# Altium schematic sheet 02-I_O.SchDoc
size 246 x 182 mm
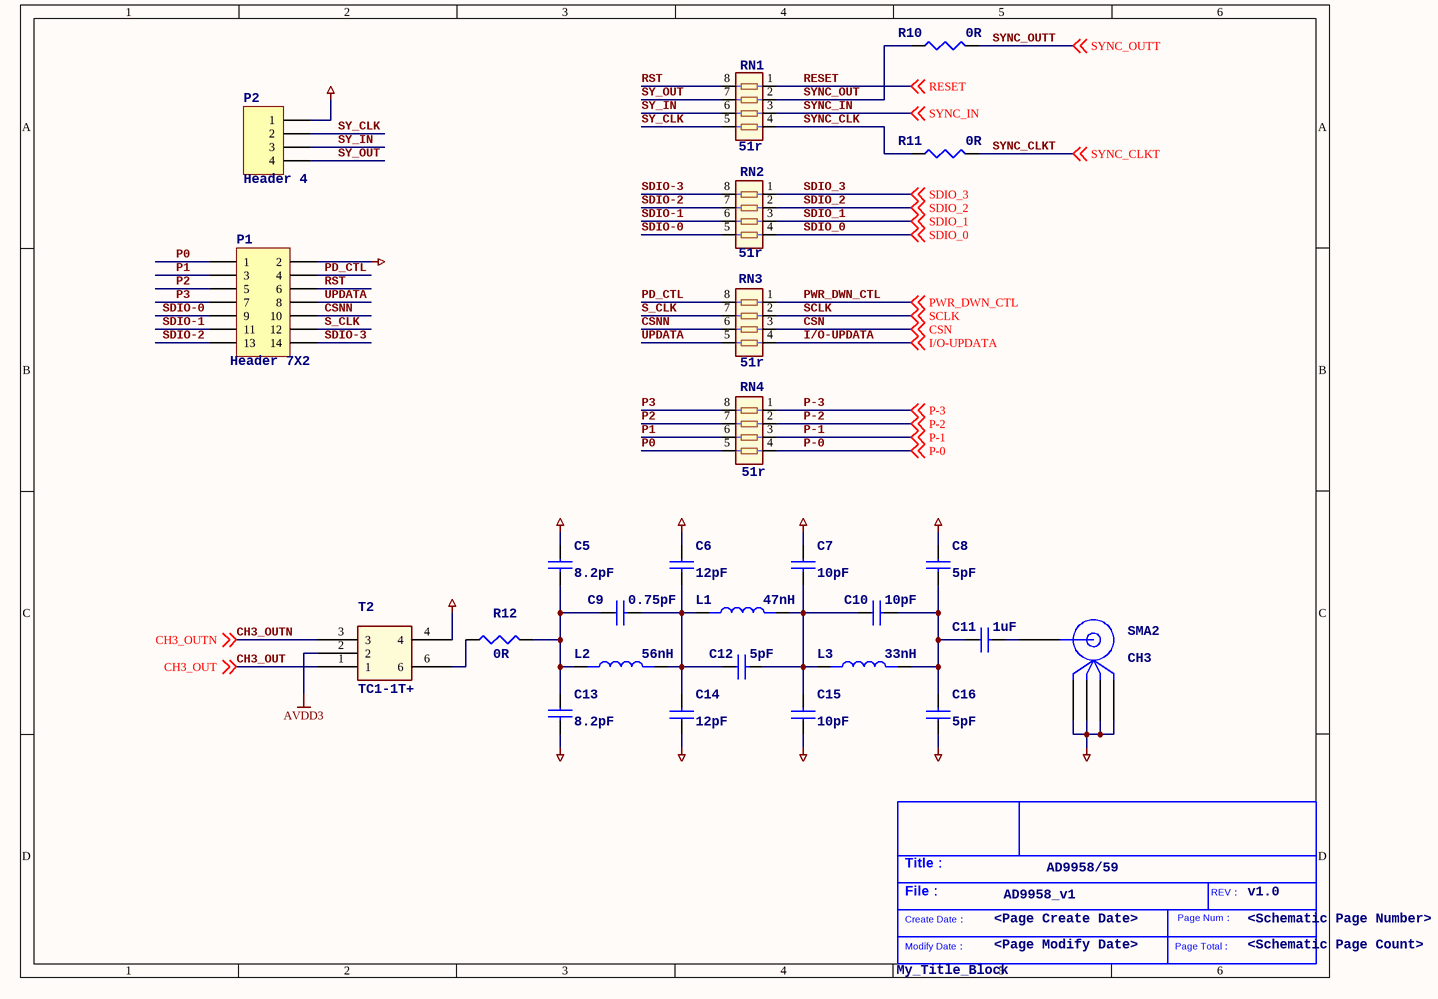
[diagram p0: 02-I_O.SchDoc]

## Parts
*  My_Title_Block  Schematic Page Count: <Schematic Page Count>  Schematic Page Number: <Schematic Page Number>  Page Modify Date: <Page Modify Date>  Page Create Date: <Page Create Date>  Revcode: v1.0  File: AD9958_v1  Title: AD9958/59  (graphical)
C5  8.2pF  [0603C]
C6  12pF  [0603C]
C7  10pF  [0603C]
C8  5pF  [0603C]
C9  0.75pF  [0603C]
C10  10pF  [0603C]
C11  1uF  [0603C]
C12  5pF  [0603C]
C13  8.2pF  [0603C]
C14  12pF  [0603C]
C15  10pF  [0603C]
C16  5pF  [0603C]
L1  47nH  [0603L]
L2  56nH  [0603L]
L3  33nH  [0603L]
P1  Header 7X2  [CON20VP2R54-2X7TM-1]
P2  Header 4  [HDR1X4]
R10  0R  [0603R]
R11  0R  [0603R]
R12  0R  [0603R]
RN1  51r  [0603RA]
RN2  51r  [0603RA]
RN3  51r  [0603RA]
RN4  51r  [0603RA]
SMA2  CH3  [SMA-SMD]
T2  TC1-1T+  [at224-1a]

## Nets
AGND: C5.1 C6.1 C7.1 C8.1 C13.2 C14.1 C15.1 C16.1 P1.2 P2.1 SMA2.2(GND) SMA2.3(GND) SMA2.4(GND) SMA2.5(GND) T2.4
AVDD3: T2.2
CH3_OUT: T2.1 ; off-sheet CH3_OUT
CH3_OUTN: T2.3 ; off-sheet CH3_OUTN
CSN: RN3.3 ; off-sheet CSN
CSNN: P1.10 RN3.6
I/O-UPDATA: RN3.4 ; off-sheet I/O-UPDATA
P0: P1.1 RN4.5
P1: P1.3 RN4.6
P2: P1.5 RN4.7
P3: P1.7 RN4.8
P-0: RN4.4 ; off-sheet P-0
P-1: RN4.3 ; off-sheet P-1
P-2: RN4.2 ; off-sheet P-2
P-3: RN4.1 ; off-sheet P-3
PD_CTL: P1.4 RN3.8
PWR_DWN_CTL: RN3.1 ; off-sheet PWR_DWN_CTL
RESET: RN1.1 ; off-sheet RESET
RST: P1.6 RN1.8
S_CLK: P1.12 RN3.7
SCLK: RN3.2 ; off-sheet SCLK
SDIO-0: P1.9 RN2.5
SDIO-1: P1.11 RN2.6
SDIO-2: P1.13 RN2.7
SDIO-3: P1.14 RN2.8
SDIO_0: RN2.4 ; off-sheet SDIO_0
SDIO_1: RN2.3 ; off-sheet SDIO_1
SDIO_2: RN2.2 ; off-sheet SDIO_2
SDIO_3: RN2.1 ; off-sheet SDIO_3
SY_CLK: P2.2 RN1.5
SY_IN: P2.3 RN1.6
SY_OUT: P2.4 RN1.7
SYNC_CLK: R11.1 RN1.4
SYNC_CLKT: R11.2 ; off-sheet SYNC_CLKT
SYNC_IN: RN1.3 ; off-sheet SYNC_IN
SYNC_OUT: R10.1 RN1.2
SYNC_OUTT: R10.2 ; off-sheet SYNC_OUTT
UPDATA: P1.8 RN3.5
NetC5_2: C5.2 C9.1 C13.1 L2.1 R12.2
NetC6_2: C6.2 C9.2 C12.1 C14.2 L1.1 L2.2
NetC7_2: C7.2 C10.1 C12.2 C15.2 L1.2 L3.1
NetC8_2: C8.2 C10.2 C11.1 C16.2 L3.2
NetC11_2: C11.2 SMA2.1
NetR12_1: R12.1 T2.6

## Notes on the sheet
- (in symbol My_Title_Block) Title：; REV：; File：; Create Date：; Page Num：; Modify Date：; Page Total：

## Library data of the parts
C5-C16 = CAP NP
L1-L3 = INDUCTANCE
P1 = Header 7X2: Header, 7-Pin, Dual row; LatestRevisionDate: 17-Jul-2002; LatestRevisionNote: Re-released for DXP Platform.; Publisher: Altium Limited
P2 = Header 4: Header, 4-Pin; LatestRevisionDate: 17-Jul-2002; LatestRevisionNote: Re-released for DXP Platform.; Publisher: Altium Limited
R10-R12 = R
RN1-RN4 = R_PACK_4
SMA2 = BNC